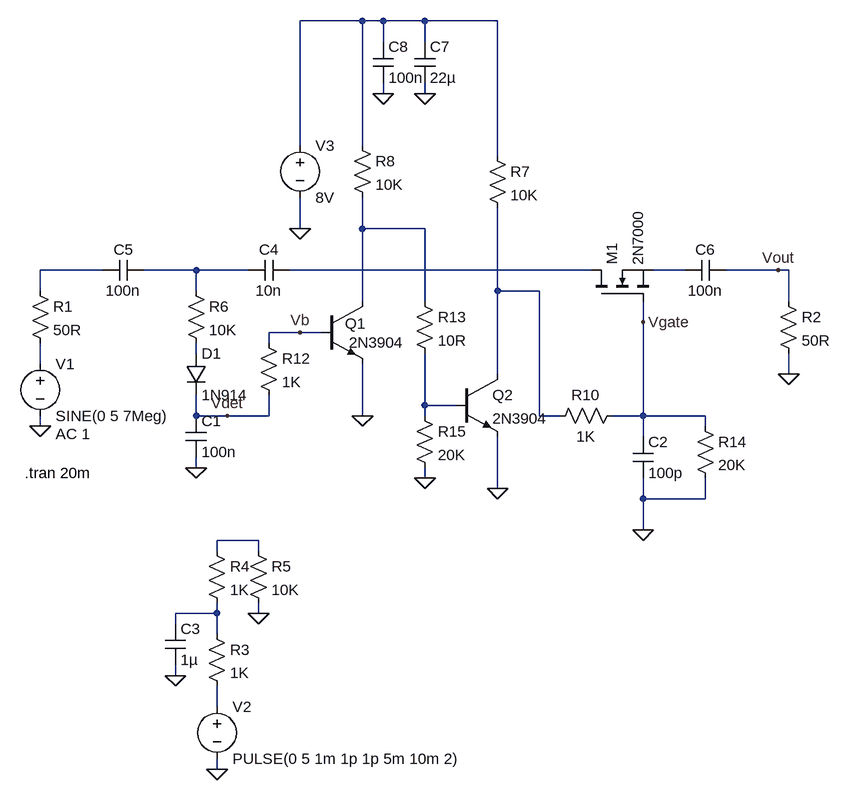
[diagram p0: schematic Raised Cosine BFO Testing 2.asc]
Raised Cosine BFO Testing 2.asc, the LTspice schematic file:
Version 4
SHEET 1 1224 836
WIRE 16 -384 -80 -384
WIRE 48 -384 16 -384
WIRE 112 -384 48 -384
WIRE 224 -384 112 -384
WIRE 48 -352 48 -384
WIRE 112 -352 112 -384
WIRE 48 -272 48 -288
WIRE 112 -272 112 -288
WIRE -80 -192 -80 -384
WIRE 16 -192 16 -384
WIRE 224 -176 224 -384
WIRE -80 -64 -80 -112
WIRE 16 -64 16 -112
WIRE 112 -64 16 -64
WIRE -384 0 -480 0
WIRE -240 0 -320 0
WIRE -160 0 -240 0
WIRE 368 0 -96 0
WIRE 512 0 464 0
WIRE 656 0 576 0
WIRE 672 0 656 0
WIRE -480 32 -480 0
WIRE -240 32 -240 0
WIRE 224 32 224 -96
WIRE 288 32 224 32
WIRE 16 48 16 -64
WIRE 112 48 112 -64
WIRE 672 48 672 0
WIRE 448 80 448 48
WIRE -80 96 -128 96
WIRE -48 96 -80 96
WIRE -128 112 -128 96
WIRE -240 128 -240 112
WIRE -480 144 -480 112
WIRE 224 160 224 32
WIRE 672 160 672 128
WIRE 112 208 112 128
WIRE 160 208 112 208
WIRE -240 224 -240 192
WIRE -192 224 -240 224
WIRE -128 224 -128 192
WIRE -128 224 -192 224
WIRE 16 224 16 144
WIRE 112 224 112 208
WIRE 288 224 288 32
WIRE 320 224 288 224
WIRE 448 224 448 80
WIRE 448 224 400 224
WIRE 544 224 448 224
WIRE -480 240 -480 224
WIRE 544 240 544 224
WIRE 448 256 448 224
WIRE -240 304 -240 288
WIRE 112 320 112 304
WIRE 224 336 224 256
WIRE 448 352 448 320
WIRE 544 352 544 320
WIRE 544 352 448 352
WIRE 448 400 448 352
WIRE -144 416 -208 416
WIRE -208 432 -208 416
WIRE -144 432 -144 416
WIRE -208 528 -208 512
WIRE -208 528 -272 528
WIRE -144 528 -144 512
WIRE -272 544 -272 528
WIRE -208 560 -208 528
WIRE -272 624 -272 608
WIRE -208 672 -208 640
WIRE -208 768 -208 752
FLAG 672 160 0
FLAG -144 528 0
FLAG -208 768 0
FLAG -480 240 0
FLAG 656 0 Vout
FLAG -272 624 0
FLAG -80 -64 0
FLAG 16 224 0
FLAG 448 80 Vgate
FLAG -240 304 0
FLAG -80 96 Vb
FLAG 448 400 0
FLAG -192 224 Vdet
FLAG 224 336 0
FLAG 112 -272 0
FLAG 48 -272 0
FLAG 112 320 0
SYMBOL voltage -480 128 R0
WINDOW 123 24 124 Left 2
WINDOW 39 0 0 Left 2
SYMATTR Value2 AC 1
SYMATTR InstName V1
SYMATTR Value SINE(0 5 7Meg)
SYMBOL voltage -208 656 R0
WINDOW 123 0 0 Left 2
WINDOW 39 0 0 Left 2
SYMATTR InstName V2
SYMATTR Value PULSE(0 5 1m 1p 1p 5m 10m 2)
SYMBOL res -496 16 R0
SYMATTR InstName R1
SYMATTR Value 50R
SYMBOL res 656 32 R0
SYMATTR InstName R2
SYMATTR Value 50R
SYMBOL res -224 544 R0
SYMATTR InstName R3
SYMATTR Value 1K
SYMBOL res -224 416 R0
SYMATTR InstName R4
SYMATTR Value 1K
SYMBOL res -160 416 R0
SYMATTR InstName R5
SYMATTR Value 10K
SYMBOL cap -288 544 R0
SYMATTR InstName C3
SYMATTR Value 1µ
SYMBOL voltage -80 -208 R0
WINDOW 123 0 0 Left 2
WINDOW 39 0 0 Left 2
SYMATTR InstName V3
SYMATTR Value 8V
SYMBOL nmos 368 48 R270
SYMATTR InstName M1
SYMATTR Value 2N7000
SYMBOL res 0 -208 R0
SYMATTR InstName R8
SYMATTR Value 10K
SYMBOL diode -256 128 R0
SYMATTR InstName D1
SYMATTR Value 1N914
SYMBOL cap -256 224 R0
SYMATTR InstName C1
SYMATTR Value 100n
SYMBOL cap 432 256 R0
SYMATTR InstName C2
SYMATTR Value 100p
SYMBOL cap -320 -16 R90
WINDOW 0 0 32 VBottom 2
WINDOW 3 32 32 VTop 2
SYMATTR InstName C5
SYMATTR Value 100n
SYMBOL cap 576 -16 R90
WINDOW 0 0 32 VBottom 2
WINDOW 3 32 32 VTop 2
SYMATTR InstName C6
SYMATTR Value 100n
SYMBOL res -256 16 R0
SYMATTR InstName R6
SYMATTR Value 10K
SYMBOL res 416 208 R90
WINDOW 0 0 56 VBottom 2
WINDOW 3 32 56 VTop 2
SYMATTR InstName R10
SYMATTR Value 1K
SYMBOL cap -96 -16 R90
WINDOW 0 0 32 VBottom 2
WINDOW 3 32 32 VTop 2
SYMATTR InstName C4
SYMATTR Value 10n
SYMBOL npn -48 48 R0
WINDOW 0 37 34 Left 2
WINDOW 3 43 63 Left 2
SYMATTR InstName Q1
SYMATTR Value 2N3904
SYMBOL res 208 -192 R0
SYMATTR InstName R7
SYMATTR Value 10K
SYMBOL res -144 96 R0
SYMATTR InstName R12
SYMATTR Value 1K
SYMBOL res 96 32 R0
SYMATTR InstName R13
SYMATTR Value 10R
SYMBOL npn 160 160 R0
SYMATTR InstName Q2
SYMATTR Value 2N3904
SYMBOL res 528 224 R0
SYMATTR InstName R14
SYMATTR Value 20K
SYMBOL cap 96 -352 R0
SYMATTR InstName C7
SYMATTR Value 22µ
SYMBOL cap 32 -352 R0
SYMATTR InstName C8
SYMATTR Value 100n
SYMBOL res 96 208 R0
SYMATTR InstName R15
SYMATTR Value 20K
TEXT -504 312 Left 2 !.tran 20m

The netlist it stands for:
* Raised Cosine BFO Testing 2.asc
V1 N009 0 SINE(0 5 7Meg) AC 1
V2 N013 0 PULSE(0 5 1m 1p 1p 5m 10m 2)
R1 N003 N009 50R
R2 Vout 0 50R
R3 N012 N013 1K
R4 N011 N012 1K
R5 N011 0 10K
C3 N012 0 1µ
V3 N001 0 8V
M1 N005 Vgate N006 N006 2N7000
R8 N001 N002 10K
D1 N008 Vdet 1N914
C1 Vdet 0 100n
C2 Vgate 0 100p
C5 N004 N003 100n
C6 Vout N006 100n
R6 N004 N008 10K
R10 Vgate N007 1K
C4 N005 N004 10n
Q1 N002 Vb 0 0 2N3904
R7 N001 N007 10K
R12 Vb Vdet 1K
R13 N002 N010 10R
Q2 N007 N010 0 0 2N3904
R14 Vgate 0 20K
C7 N001 0 22µ
C8 N001 0 100n
R15 N010 0 20K
.model D D
.lib standard.dio
.model NPN NPN
.model PNP PNP
.lib standard.bjt
.model NMOS NMOS
.model PMOS PMOS
.lib standard.mos
.tran 20m
.backanno
.end